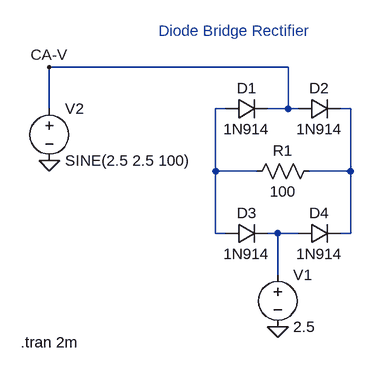
[diagram p0: schematic diode_brige_rectifier_bb.asc]
diode_brige_rectifier_bb.asc, the LTspice schematic file:
Version 4
SHEET 1 880 680
WIRE 224 64 -144 64
WIRE -144 128 -144 64
WIRE 128 128 112 128
WIRE 224 128 224 64
WIRE 224 128 192 128
WIRE 240 128 224 128
WIRE 320 128 304 128
WIRE 112 224 112 128
WIRE 176 224 112 224
WIRE 320 224 320 128
WIRE 320 224 256 224
WIRE 112 320 112 224
WIRE 128 320 112 320
WIRE 208 320 192 320
WIRE 240 320 208 320
WIRE 320 320 320 224
WIRE 320 320 304 320
WIRE 208 384 208 320
FLAG 208 464 0
FLAG -144 208 0
FLAG -144 64 CA-V
SYMBOL diode 128 144 R270
WINDOW 0 32 32 VTop 2
WINDOW 3 0 32 VBottom 2
SYMATTR InstName D1
SYMATTR Value 1N914
SYMBOL diode 240 144 R270
WINDOW 0 32 32 VTop 2
WINDOW 3 0 32 VBottom 2
SYMATTR InstName D2
SYMATTR Value 1N914
SYMBOL diode 128 336 R270
WINDOW 0 32 32 VTop 2
WINDOW 3 0 32 VBottom 2
SYMATTR InstName D3
SYMATTR Value 1N914
SYMBOL diode 240 336 R270
WINDOW 0 32 32 VTop 2
WINDOW 3 0 32 VBottom 2
SYMATTR InstName D4
SYMATTR Value 1N914
SYMBOL res 272 208 R90
WINDOW 0 0 56 VBottom 2
WINDOW 3 32 56 VTop 2
SYMATTR InstName R1
SYMATTR Value 100
SYMBOL voltage 208 368 R0
WINDOW 123 0 0 Left 0
WINDOW 39 0 0 Left 0
SYMATTR InstName V1
SYMATTR Value 2.5
SYMBOL voltage -144 112 R0
WINDOW 123 0 0 Left 0
WINDOW 39 0 0 Left 0
SYMATTR InstName V2
SYMATTR Value SINE(2.5 2.5 100)
TEXT 24 8 Left 2 ;Diode Bridge Rectifier
TEXT -188 488 Left 2 !.tran 2m

The netlist it stands for:
* diode_brige_rectifier_bb.asc
D1 N001 CA-V 1N914
D2 CA-V N002 1N914
D3 N001 N003 1N914
D4 N003 N002 1N914
R1 N002 N001 100
V1 N003 0 2.5
V2 CA-V 0 SINE(2.5 2.5 100)
.model D D
.lib standard.dio
* Diode Bridge Rectifier
.tran 2m
.backanno
.end